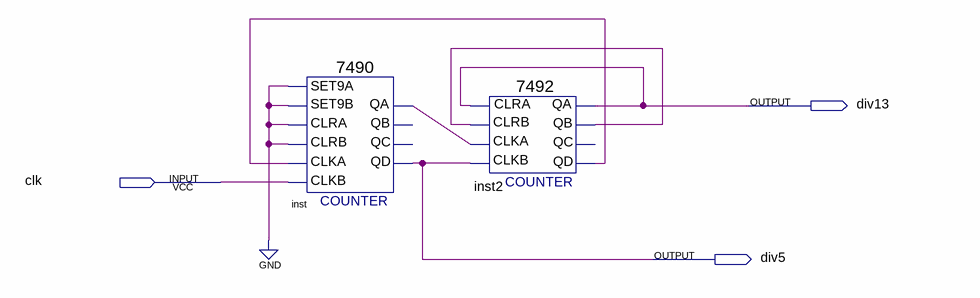
[diagram p0: schematic sheet]
// Quartus schematic div_5_13.bdf as structural Verilog: 2 symbols, 3 pins
module div_5_13 (
  input  clk,
  output div13,
  output div5
);

  wire inst2_qb, inst2_qd, inst_qa;

  \7490  inst (
    .SET9A(1'b0), .CLRA(1'b0), .SET9B(1'b0), .CLKB(clk), .CLKA(inst2_qd), .CLRB(1'b0), .QD(div5), .QA(inst_qa));  // open: QB, QC
  \7492  inst2 (
    .CLKB(div5), .CLRA(div13), .CLKA(inst_qa), .CLRB(inst2_qb), .QB(inst2_qb), .QD(inst2_qd), .QA(div13));  // open: QC
endmodule
